# EAGLE design programmer_header (EAGLE 9.3.0)
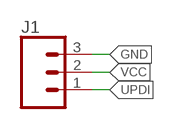
[diagram p0: schematic, sheet 1]

## Parts
J1  CONN_03LONGPADS  [1X03_LONGPADS]

## Nets
GND: J1.3
UPDI: J1.1
VCC: J1.2

## Library data of the parts
J1 = SparkFun-Connectors:CONN_03: Multi connection point. Often used as Generic Header-pin footprint for 0.1 inch spaced/style header connections On any of the 0.1 inch spaced packages, you can populate with these: Break Away Headers - Straight <https://www.sparkfun.com/products/116> (PRT-00116) Break Away Male Headers - Right Angle <https://www.sparkfun.com/products/553> (PRT-00553) Female Headers <https://www.sparkfun.com/products/115> (PRT-00115) Break Away Headers - Machine Pin <https://www.sparkfun.com/products/117> (PRT-00117) Break Away Female Headers - Swiss Machine Pin <https://www.sparkfun.com/products/743> (PRT-00743) Stackable Header - 3 Pin (Female, 0.1") <https://www.sparkfun.com/products/13875> (PRT-13875) For SCREWTERMINALS and SPRING TERMINALS visit here: Screw Terimnals on SparkFun.com <https://www.sparkfun.com/search/results?term=Screw+Terminals> (5mm/3.5mm/2.54mm spacing) This device is also useful as a general connection point to wire up your design to another part of your project. Our various solder wires solder well into these plated through hole pads. Hook-Up Wire - Assortment (Stranded, 22 AWG) <https://www.sparkfun.com/products/11375> (PRT-11375) Hook-Up Wire - Assortment (Solid Core, 22 AWG) <https://www.sparkfun.com/products/11367> (PRT-11367) View the entire wire category on our website here <https://www.sparkfun.com/categories/141> Special notes: Molex polarized connector foot print use with SKU : PRT-08232 with associated crimp pins and housings.

## Board
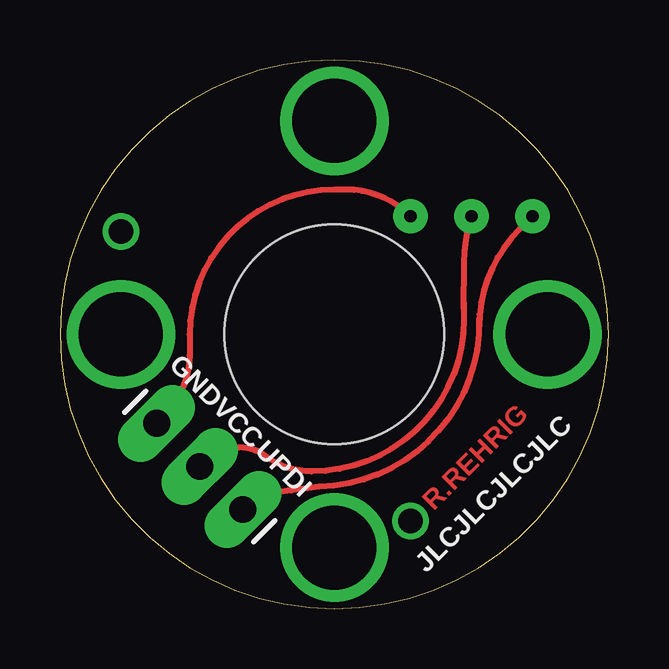
[diagram p1: board, top side]
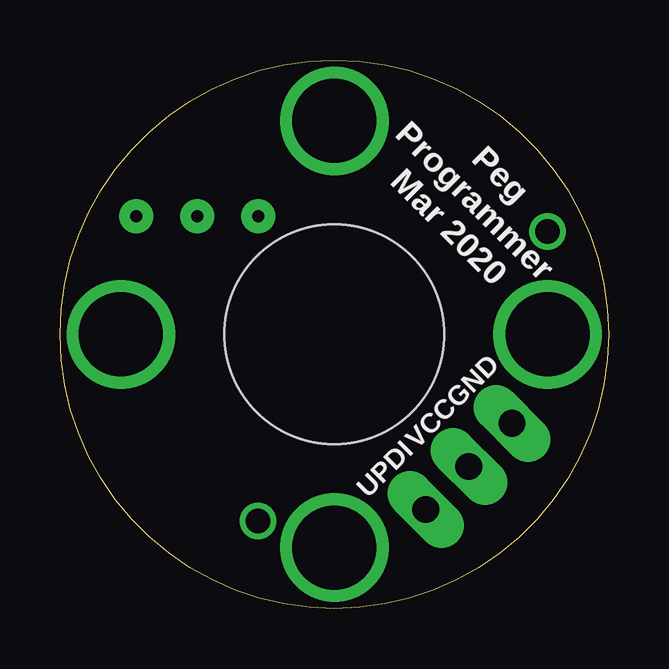
[diagram p2: board, bottom side, seen from below]

Size 22.86 x 22.86 mm. Coordinates in mm from the lower left corner, seen from the top.
Outline: 11.43,22.86 arc90 0,11.43 arc90 11.43,0 arc90 22.86,11.43 arc90 11.43,22.86
Copper layers (1*16): Top 0.035mm / dielectric 1.5mm / Bottom 0.035mm
Design rules "standard_rob": minimum track width 7mil, minimum drill 12mil, track to track 7mil, track to pad 7mil, pad to pad 7mil, via to via 7mil, smd to smd 7mil, copper to edge 10mil, drill to drill 8mil, minimum pad ring 10mil, minimum via ring 8mil, stop-mask expansion 4mil, vias tented up to drill 12mil, thermal gap 10mil
Holes 9.14 mm at 11.43,11.43

### Footprints (pad centres in the part's own frame; a part is rotated, then mirrored left to right if it is on the bottom)
1X03_LONGPADS = drill 1.118 pad 1.88 long: 1 0,0; 2 2.54,0; 3 5.08,0

### Placement (x,y rotation side)
J1  7.62,4.13 135 top

### Tracks (layer width: path | path; a pad name or v marks a point on that pad's centre or on a via)
GND  (via drill 0.51 pad 1.42)
  Top 0.254: J1.3 arc-45 4.11,7.92 4.44,8.26 arc45 5.4,10.55 5.4,11.43 arc-90 11.43,17.46 11.92,17.46 arc-45 v14.6,16.35
N$1  (via drill 3.5)
  other vias: 2.54,11.43 11.43,2.54 20.32,11.43 11.43,20.32
N$32  (via drill 1.02)
  other vias: 2.54,15.72
N$33  (via drill 1.02)
  other vias: 14.6,3.65
UPDI  (via drill 0.51 pad 1.42)
  Top 0.254: v19.68,16.35 19.15,15.81 arc45 17.46,11.75 17.46,12.07 arc-90 10.79,5.08 10.33,5.02 arc3 8.26,4.7 arc63 J1.1
VCC  (via drill 0.51 pad 1.42)
  Top 0.254: 16.83,12.73 16.83,12.48 | 16.83,12.48 16.83,12.07 arc-90 10.48,5.72 | 10.48,5.72 | 10.48,5.72 arc-37 8.57,6.35 arc74 6.35,6.35 arc4 J1.2 | 16.83,12.48 16.84,14.39 arc-17 v17.14,16.35

### Text on the board
Top: R.REHRIG
tPlace: GND | VCC | UPDI | JLCJLCJLCJLC
bPlace: Peg / Programmer / Mar 2020 | GND | VCC | UPDI